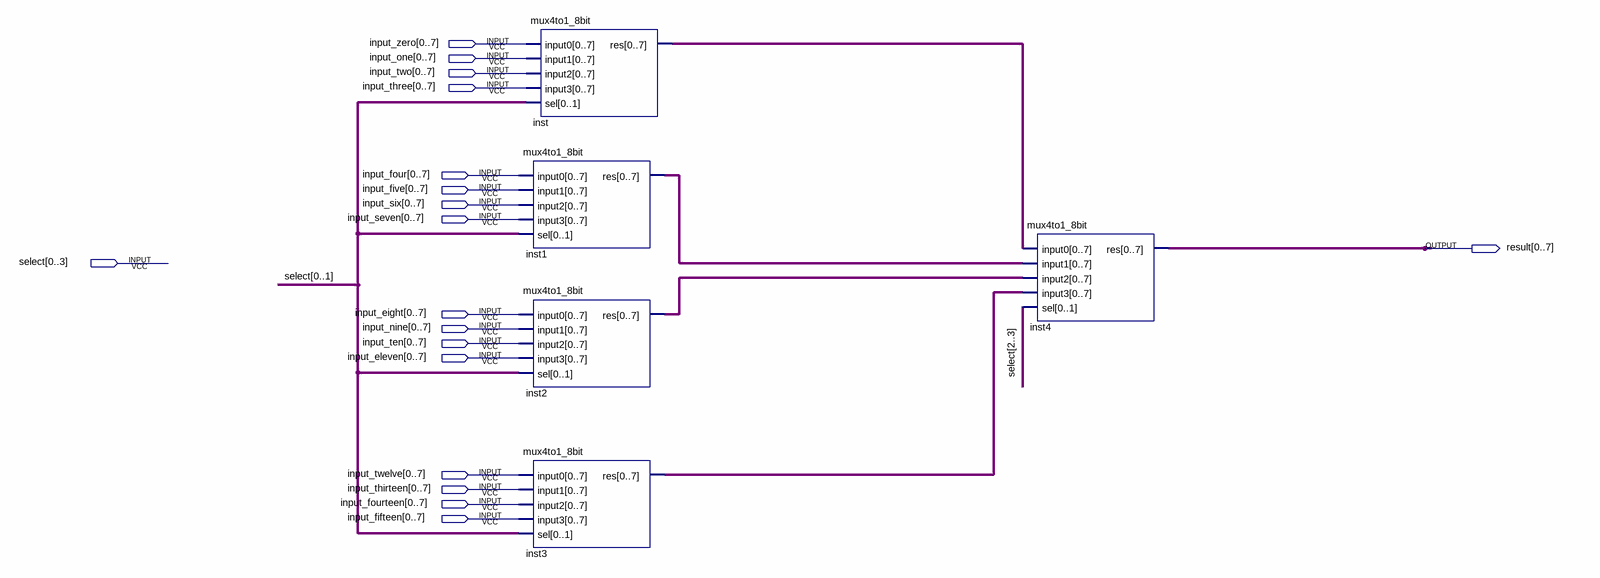
[diagram p0: schematic sheet]
// Quartus schematic mux16to1_8bit.bdf as structural Verilog: 5 symbols, 18 pins
module mux16to1_8bit (
  input  [0:7] input_zero,
  input  [0:7] input_one,
  input  [0:7] input_two,
  input  [0:7] input_three,
  input  [0:7] input_four,
  input  [0:7] input_five,
  input  [0:7] input_six,
  input  [0:7] input_seven,
  input  [0:3] select,
  input  [0:7] input_eight,
  input  [0:7] input_nine,
  input  [0:7] input_ten,
  input  [0:7] input_eleven,
  input  [0:7] input_twelve,
  input  [0:7] input_thirteen,
  input  [0:7] input_fourteen,
  input  [0:7] input_fifteen,
  output [0:7] result
);

  wire [7:0] inst1_res, inst2_res, inst3_res, inst_res;

  mux4to1_8bit inst (
    .input0(input_zero), .input1(input_one), .input2(input_two), .input3(input_three), .sel(select[0:1]),
    .res(inst_res));
  mux4to1_8bit inst1 (
    .input0(input_four), .input1(input_five), .input2(input_six), .input3(input_seven), .sel(select[0:1]),
    .res(inst1_res));
  mux4to1_8bit inst2 (
    .input0(input_eight), .input1(input_nine), .input2(input_ten), .input3(input_eleven), .sel(select[0:1]),
    .res(inst2_res));
  mux4to1_8bit inst3 (
    .input0(input_twelve), .input1(input_thirteen), .input2(input_fourteen), .input3(input_fifteen),
    .sel(select[0:1]), .res(inst3_res));
  mux4to1_8bit inst4 (
    .input0(inst_res), .input1(inst1_res), .input2(inst2_res), .input3(inst3_res), .sel(select[2:3]),
    .res(result));
endmodule
